# Altium schematic sheet 4g.SchDoc
size A2
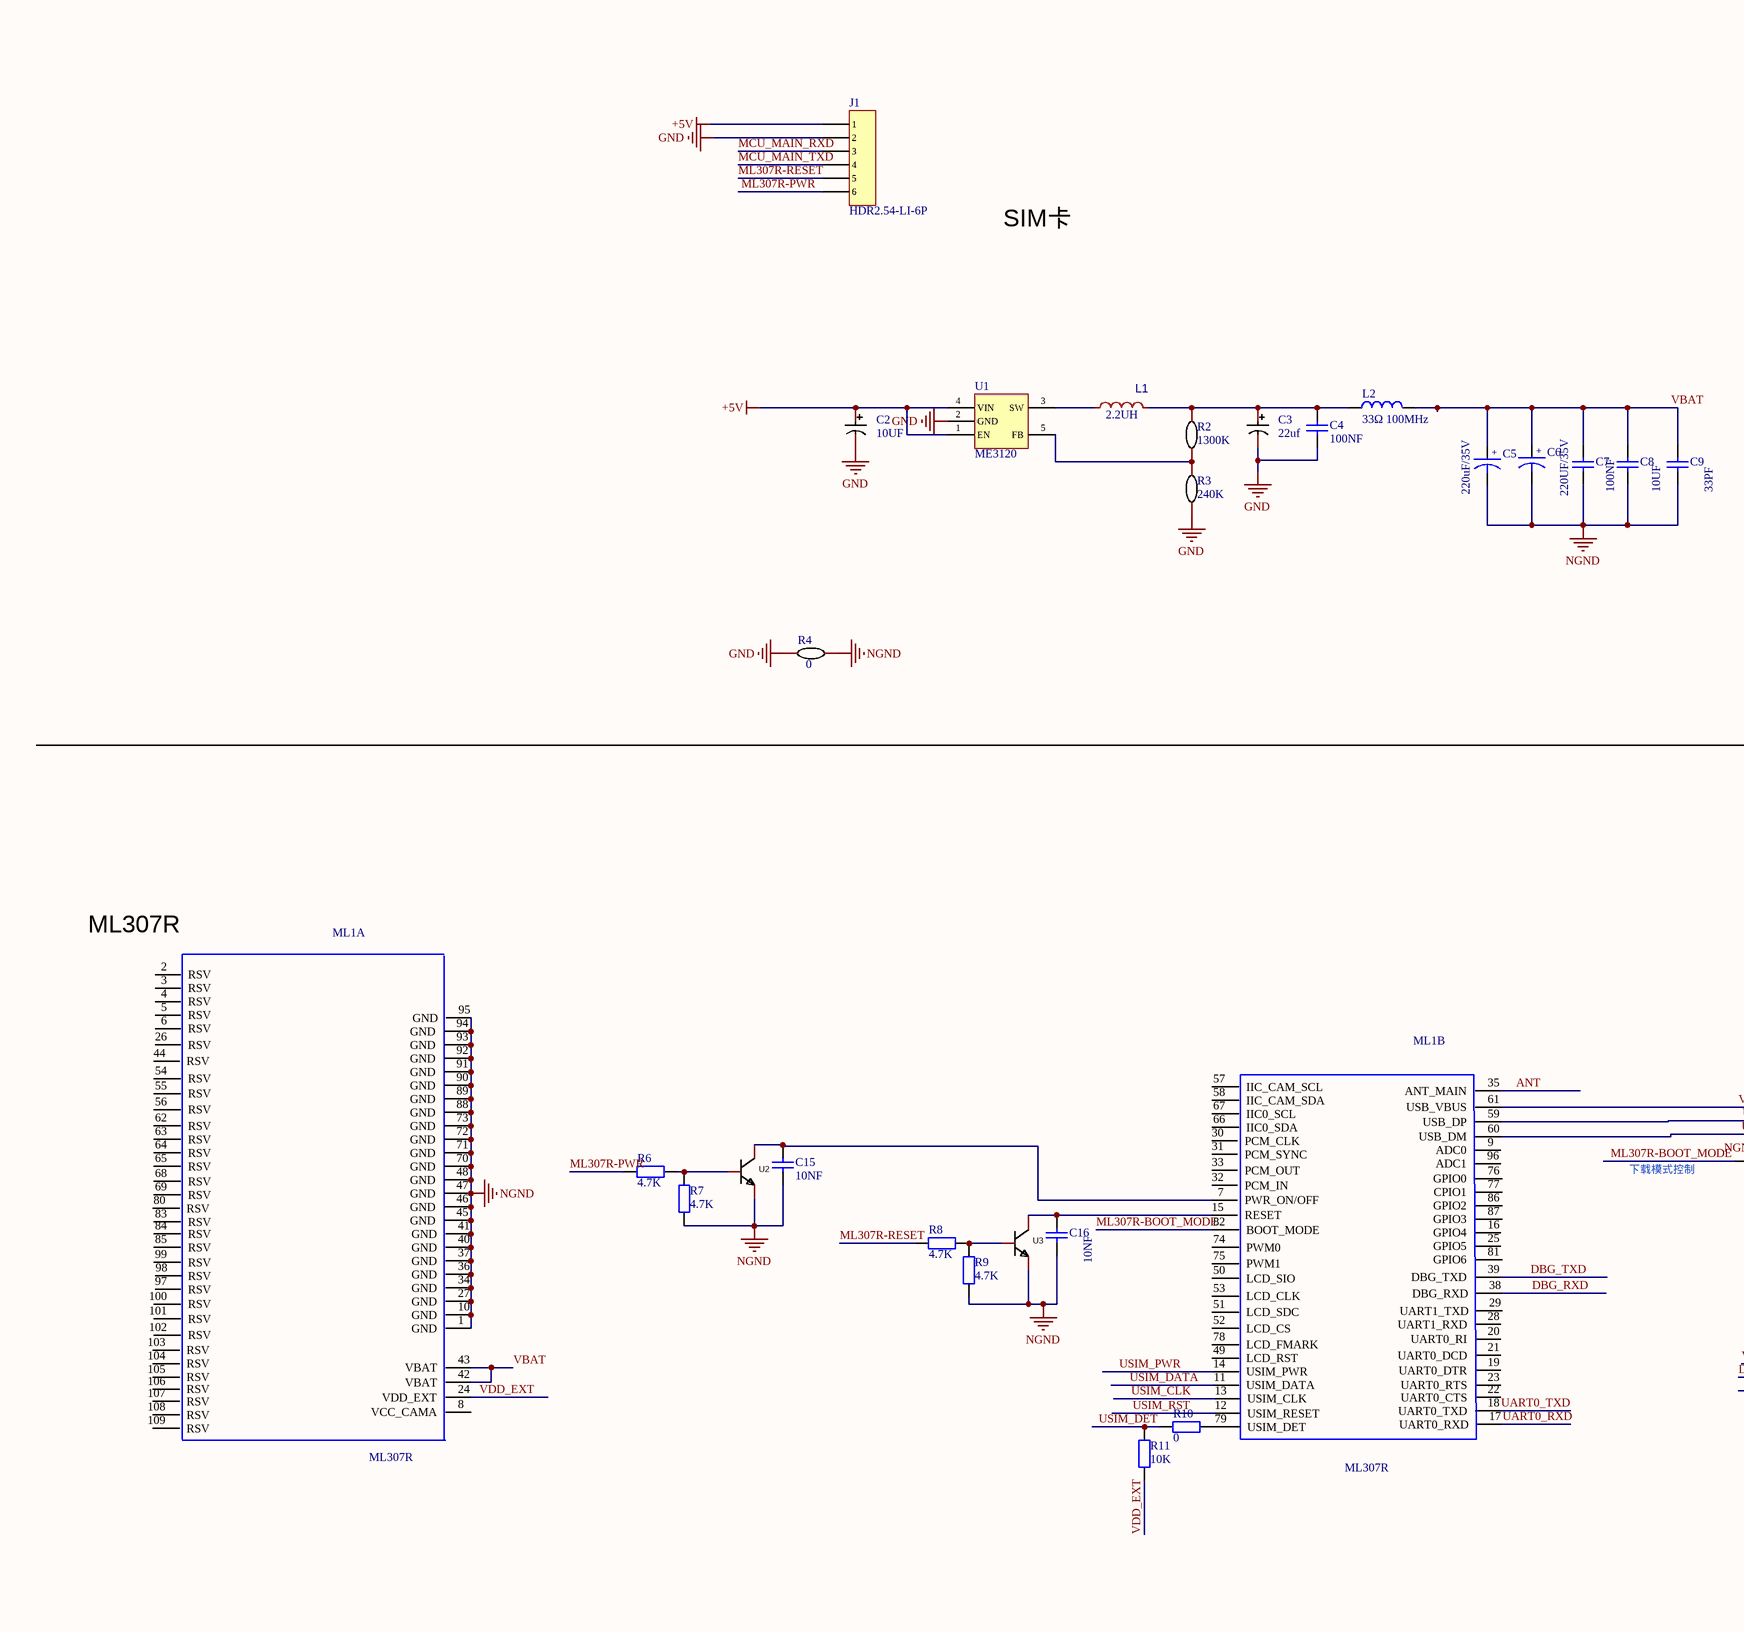
[diagram p0: 4g.SchDoc, left]
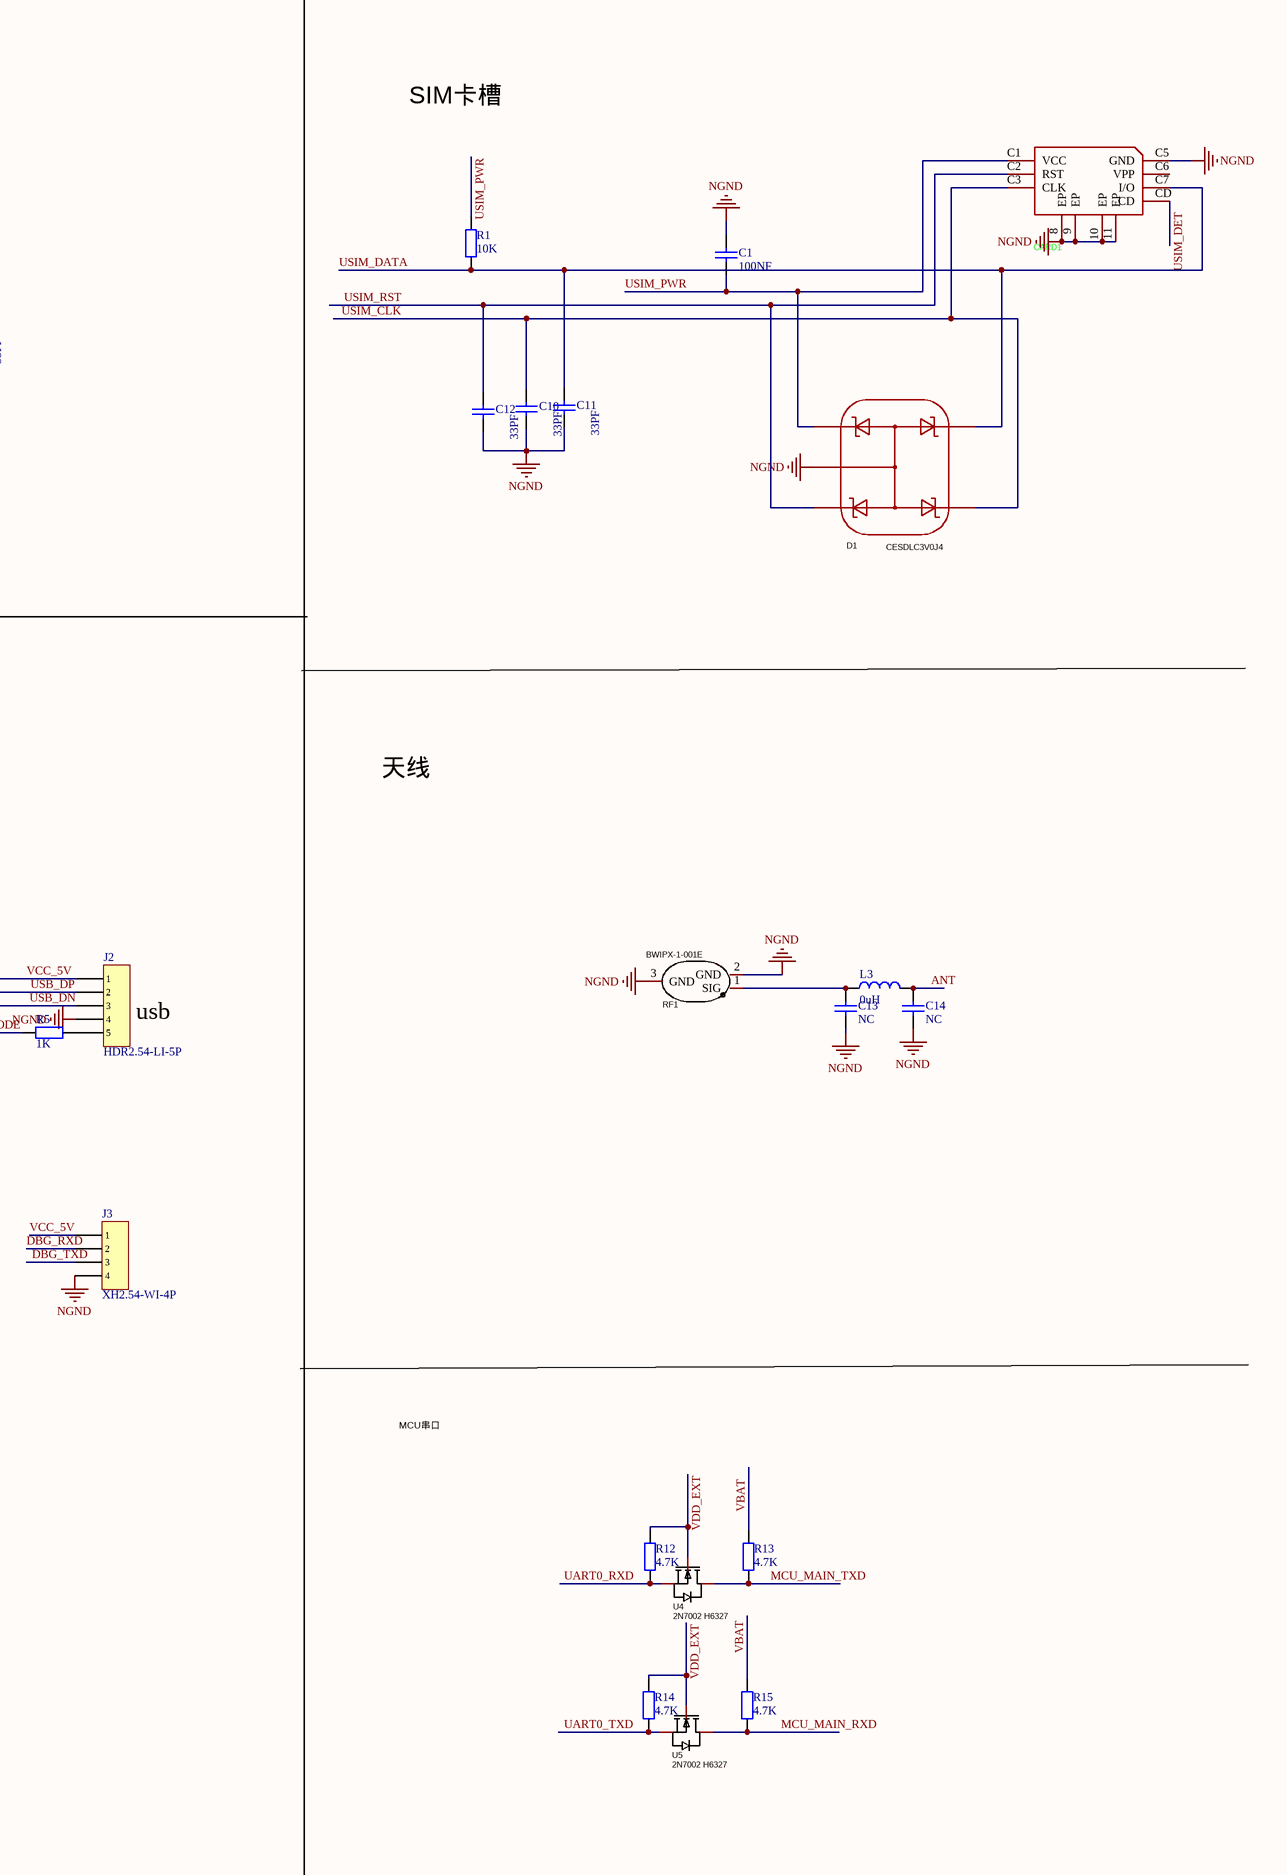
[diagram p1: 4g.SchDoc, right]

## Parts
C1  100NF  [C-0603]
C2  10UF  [CA-3216]
C3  22uf  [CA-3528]
C4  100NF  [R-0603]
C5  220uF/35V  [CASE-B_3528]
C6  220UF/35V  [CASE-B_3528]
C7  100NF  [C-0603]
C8  10UF  [C-0603]
C9  33PF  [C-0603]
C10  33PF  [C-0603]
C11  33PF  [C-0603]
C12  33PF  [C-0603]
C13  NC  [C-0603]
C14  NC  [C-0603]
C15  10NF  [C-0603]
C16  10NF  [C-0603]
CARD1  SMN-303  [SIM-SMD_SMN-303]  (value not drawn)
D1  CESDLC3V0J4  [SOT-353_L2.1-W1.3-P0.65-LS2.3-BR]
J1  HDR2.54-LI-6P  [HDR2.54-LI-6P]
J2  HDR2.54-LI-5P  [2.54--5P]
J3  XH2.54-WI-4P  [2.54--4P]
L1  2.2UH  [IND-SMD_L2.5-W2.0_MHCHL2520]
L2  33Ω 100MHz  [R-0805]
L3  0uH  [R-0603]
ML1  ML307R  [MOD_ML307X_LGA109P]  (parts A,B of 2)
R1  10K  [R-0603]
R2  1300K  [R-0603]
R3  240K  [R-0603]
R4  0  [R-0805]
R5  1K  [R-0603]
R6  4.7K  [R-0603]
R7  4.7K  [R-0603]
R8  4.7K  [R-0603]
R9  4.7K  [R-0603]
R10  0  [R-0603]
R11  10K  [R-0603]
R12  4.7K  [R-0603]
R13  4.7K  [R-0603]
R14  4.7K  [R-0603]
R15  4.7K  [R-0603]
RF1  BWIPX-1-001E  [IPEX-SMD_BWIPX-1-001E]
U1  ME3120  [SOT-23-5]
U2  SS8050  [SOT-23-3_(三极管)]  (value not drawn)
U3  SS8050  [SOT-23-3_(三极管)]  (value not drawn)
U4  2N7002 H6327  [PG-SOT23-3_L2.9-W1.3-P1.90-LS2.4-BR]
U5  2N7002 H6327  [PG-SOT23-3_L2.9-W1.3-P1.90-LS2.4-BR]

## Nets
+5V: C2.1 J1.1 U1.1(EN) U1.4(VIN)
GND: C2.2 C3.2 C4.1 J1.2 R3.2 R4.2 U1.2(GND)
NGND: C1.2 C5.2 C6.2 C7.1 C8.1 C9.1 C10.1 C11.1 C12.1 C13.2 C14.2 C15.1 C16.1 CARD1.8(EP) CARD1.9(EP) CARD1.10(EP) CARD1.11(EP) CARD1.C5(GND) D1.2 J2.4 J3.4 ML1.1(GND) ML1.10(GND) ML1.27(GND) ML1.34(GND) ML1.36(GND) ML1.37(GND) ML1.40(GND) ML1.41(GND) ML1.45(GND) ML1.46(GND) ML1.47(GND) ML1.48(GND) ML1.70(GND) ML1.71(GND) ML1.72(GND) ML1.73(GND) ML1.88(GND) ML1.89(GND) ML1.90(GND) ML1.91(GND) ML1.92(GND) ML1.93(GND) ML1.94(GND) ML1.95(GND) R4.1 R7.1 R9.1 RF1.2(GND) RF1.3(GND) U2.2(E) U3.2(E)
ANT: C14.1 L3.2 ML1.35(ANT_MAIN)
DBG_RXD: J3.2 ML1.38(DBG_RXD)
DBG_TXD: J3.3 ML1.39(DBG_TXD)
MCU_MAIN_RXD: J1.3 R15.1 U5.3(D)
MCU_MAIN_TXD: J1.4 R13.1 U4.3(D)
ML307R-BOOT_MODE: ML1.82(BOOT_MODE) R5.2
ML307R-PWR: J1.6 R6.1
ML307R-RESET: J1.5 R8.1
UART0_RXD: ML1.17(UART0_RXD) R12.1 U4.2(S)
UART0_TXD: ML1.18(UART0_TXD) R14.1 U5.2(S)
USB_DN: J2.3 ML1.60(USB_DM)
USB_DP: J2.2 ML1.59(USB_DP)
USIM_CLK: C10.2 CARD1.C3(CLK) D1.4 ML1.13(USIM_CLK)
USIM_DATA: C11.2 CARD1.C7(I/O) D1.5 ML1.11(USIM_DATA) R1.1
USIM_DET: CARD1.CD R10.2 R11.1
USIM_PWR: C1.1 CARD1.C1(VCC) D1.1 ML1.14(USIM_PWR) R1.2
USIM_RST: C12.2 CARD1.C2(RST) D1.3 ML1.12(USIM_RESET)
VBAT: C5.1 C6.1 C7.2 C8.2 C9.2 L2.2 ML1.42(VBAT) ML1.43(VBAT) R13.2 R15.2
VCC_5V: J2.1 J3.1 ML1.61(USB_VBUS)
VDD_EXT: ML1.24(VDD_EXT) R11.2 R12.2 R14.2 U4.1(G) U5.1(G)
NetC3_1: C3.1 C4.2 L1.2 L2.1 R2.1
NetC13_1: C13.1 L3.1 RF1.1(SIG)
NetC15_2: C15.2 ML1.7(PWR_ON/OFF) U2.3(C)
NetC16_2: C16.2 ML1.15(RESET) U3.3(C)
NetJ2_5: J2.5 R5.1
NetL1_1: L1.1 U1.3(SW)
NetML1_79: ML1.79(USIM_DET) R10.1
NetR2_2: R2.2 R3.1 U1.5(FB)
NetR6_2: R6.2 R7.2 U2.1(B)
NetR8_2: R8.2 R9.2 U3.1(B)

Not connected (* = marked no-connect by the designer): CARD1 C6(VPP); ML1 2(RSV) 3(RSV) 4(RSV) 5(RSV) 6(RSV) 8(VCC_CAMA) 9(ADC0) 16(GPIO4) 19(UART0_DTR) 20(UART0_RI) 21(UART0_DCD) 22(UART0_CTS) 23(UART0_RTS) 25(GPIO5) 26(RSV) 28(UART1_RXD) 29(UART1_TXD) 30(PCM_CLK) 31(PCM_SYNC) 32(PCM_IN) 33(PCM_OUT) 44(RSV) 49(LCD_RST) 50(LCD_SIO) 51(LCD_SDC) 52(LCD_CS) 53(LCD_CLK) 54(RSV) 55(RSV) 56(RSV) 57(IIC_CAM_SCL) 58(IIC_CAM_SDA) 62(RSV) 63(RSV) 64(RSV) 65(RSV) 66(IIC0_SDA) 67(IIC0_SCL) 68(RSV) 69(RSV) 74(PWM0) 75(PWM1) 76(GPIO0) 77(CPIO1) 78(LCD_FMARK) 80(RSV) 81(GPIO6) 83(RSV) 84(RSV) 85(RSV) 86(GPIO2) 87(GPIO3) 96(ADC1) 97(RSV) 98(RSV) 99(RSV) 100(RSV) 101(RSV) 102(RSV) 103(RSV) 104(RSV) 105(RSV) 106(RSV) 107(RSV) 108(RSV) 109(RSV)

## Notes on the sheet
- SIM卡
- SIM卡槽
- (near ML1) ML307R
- 天线
- 下载模式控制
- (near J2) usb
- MCU串口
- (in symbol C电解电容_1) +

## Library data of the parts
C1 C4 C7-C16 = 0603' 100pF 5% 50V NP0 车规: 贴片电容; 品牌: 国巨; 华芯物料编号: HXE0202045001; 厂商型号: AC0603JRNPO9BN101
C2 = KF470M050E110A: Manufacturer: CapXon(丰宾); Value: 470uF; Add into BOM: yes; Tolerance: ±20%; Rated Voltage: 50V; φD: 6.3mm; L: 11mm; Lifetime @ Temp: 2000hrs@105℃; Name: 10UF; Symbol: KF470M050E110A; Device: KF470M050E110A; Supplier: LCSC; Manufacturer Part: KF470M050E110A; Supplier Part: C59347; JLCPCB Part Class: 扩展库; LCSC Part Name: 47uF ±20% 50V; Supplier Footprint: 插件,D6.3xL11mm; Datasheet: https://atta.szlcsc.com/upload/public/pdf/source/20160702/1467448308274.pdf; Convert to PCB: yes; Lead Spacing: 2.5mm
C3 = KF470M050E110A: Manufacturer: CapXon(丰宾); Name: 10UF; Value: 470uF; Add into BOM: yes; Tolerance: ±20%; Rated Voltage: 50V; φD: 6.3mm; L: 11mm; Lifetime @ Temp: 2000hrs@105℃; Symbol: KF470M050E110A; Device: KF470M050E110A; Supplier: LCSC; Manufacturer Part: KF470M050E110A; Supplier Part: C59347; JLCPCB Part Class: 扩展库; LCSC Part Name: 47uF ±20% 50V; Supplier Footprint: 插件,D6.3xL11mm; Datasheet: https://atta.szlcsc.com/upload/public/pdf/source/20160702/1467448308274.pdf; Convert to PCB: yes; Lead Spacing: 2.5mm
C5 C6 = C电解电容_1: 电容
CARD1 = SMN-303: Manufacturer: XUNPU(讯普); Add into BOM: yes; Card Connection Mode: 自弹式; Card Type: NanoSIM卡; Connector Type: 卡座; Card Detection: 有插卡检测; Symbol: SMN-303; Device: SMN-303; LCSC Part Name: 自弹式 NanoSIM卡 卡座; Supplier Part: C266888; Manufacturer Part: SMN-303; Supplier Footprint: SMD; JLCPCB Part Class: Extended Part; Datasheet: https://item.szlcsc.com/datasheet/SMN-303/256999.html; Supplier: LCSC; Convert to PCB: yes; Supplementary Features: -; Height Above Board: 1.37mm; Operating Temperature: -40℃~+85℃
D1 = CESDLC3V0J4: Manufacturer: CJ(江苏长电/长晶); Add into BOM: yes; polarity: 单向; Reverse Stand-Off Voltage (Vrwm): 3V; Maximum Clamping Voltage: 8V; Peak Pulse Current (Ipp)@10/1000us: 2.5A; Breakdown Voltage: 5.3V; Type: ESD; Symbol: CESDLC3V0J4; Device: CESDLC3V0J4; LCSC Part Name: 单向ESD; Supplier Part: C337697; Manufacturer Part: CESDLC3V0J4; Supplier Footprint: SOT-353; JLCPCB Part Class: Extended Part; Datasheet: https://atta.szlcsc.com/upload/public/pdf/source/20181121/C337697_AC0D153A44294AFEE34B0495F85181F2.pdf; Supplier: LCSC; Convert to PCB: yes
J1 = HDR2.0-LI-6P: 直插立式单排针
J2 = HDR2.54-LI-5P: 直插立式单排针
J3 = XH2.54-WI-4P: XH卧式直插座
L1 = FTC252012S2R2MBCA: Symbol: FTC252012S2R2MBCA
L2 = 0603' 33Ω 100MHz 3A 车规: 磁珠; 品牌: 村田; 厂商型号: BLM18PG330SH1D; 华芯物料编号: HXE0301100005
L3 = 通用电感: 品牌: *; 厂商型号: *
ML1 = MOD_ML307X_LGA109P: MOD_ML307R_LCC48+LGA61_17.7mm*15.8mm; Vendor: 中移物联网有限公司; Value: ML307X; Manufacturer: ML307X; PCB DECAL: MOD_ML307X_LGA109P
R1 = 通用电阻
R2 R3 = 0805W8F1002T5E_C17414: 电阻类型:厚膜电阻;阻值:0; Manufacturer: UNI-ROYAL(厚声); Name: 0; Add into BOM: yes; Value: 100kΩ; Tolerance: ±1%; Power(Watts): 125mW; Temperature Coefficient: ±100ppm/℃; Overload Voltage (Max): 150V; Symbol: 0805W8F1002T5E; Device: 0805W8F1002T5E_C17414; LCSC Part Name: 10kΩ±1%125mW; Supplier Part: C17414; Manufacturer Part: 0805W8F1002T5E; Supplier Footprint: 0805; JLCPCB Part Class: BasicPart; Datasheet: https://atta.szlcsc.com/upload/public/pdf/source/20200306/C422600_1E6D84923E4A46A82E41ADD87F860B5C.pdf; Supplier: LCSC; Convert to PCB: yes; Type: 厚膜电阻; Operating Temperature Range: -55℃~+155℃
R4 = 0805W8F1002T5E_C17414: 电阻类型:厚膜电阻;阻值:0; Manufacturer: UNI-ROYAL(厚声); Add into BOM: yes; Value: 100kΩ; Tolerance: ±1%; Power(Watts): 125mW; Temperature Coefficient: ±100ppm/℃; Overload Voltage (Max): 150V; Name: 0; Symbol: 0805W8F1002T5E; Device: 0805W8F1002T5E_C17414; LCSC Part Name: 10kΩ±1%125mW; Supplier Part: C17414; Manufacturer Part: 0805W8F1002T5E; Supplier Footprint: 0805; JLCPCB Part Class: BasicPart; Datasheet: https://atta.szlcsc.com/upload/public/pdf/source/20200306/C422600_1E6D84923E4A46A82E41ADD87F860B5C.pdf; Supplier: LCSC; Convert to PCB: yes; Type: 厚膜电阻; Operating Temperature Range: -55℃~+155℃
R5-R15 = 通用电阻: 贴片电阻，未编号，未录入华芯元件库，临时封装，包括0201，0402，0603，0805，1206，1210，1812，2010，2512
RF1 = BWIPX-1-001E: Manufacturer: BAT WIRELESS(蝙蝠无线); Add into BOM: yes; Connector Type: 板端; Interface Type: 内针; Number of Ports: 1; Frequency-Max: 6GHz; RF Series: IPEX; Impedance: 50Ω; Symbol: BWIPX-1-001E; Device: BWIPX-1-001E; LCSC Part Name: IPEX 内针; Supplier Part: C496552; Manufacturer Part: BWIPX-1-001E; Supplier Footprint: SMD; JLCPCB Part Class: Extended Part; Datasheet: https://atta.szlcsc.com/upload/public/pdf/source/20201223/C496552_05E5A9956EAE1A8819C5051D085B1DED.pdf; Supplier: LCSC; Convert to PCB: yes; Interface Diameter: -; Interface Length/Height: -; Style: -; Operating Temperature Range: -
U1 = ME3120: 电源芯片; 品牌: 西安航天民芯; 厂商型号: MT3410LB; 华芯物料编号: HXE0003027001
U2 U3 = SS8050 NPN SOT-23: Manufacturer: 宏迦橙; Symbol: SS8050_C7420370; Add into BOM: yes; Transistor Type: NPN; Collector Current (Ic): 1.5A; Collector-Emitter Breakdown Voltage (Vceo): 25V; Power Dissipation (Pd): 300mW; DC Current Gain (hFE@Ic,Vce): 120@100mA,1.0V; Transition Frequency (fT): 100MHz; Collector Cut-Off Current (Icbo): 100nA; Collector-Emitter Saturation Voltage (VCE(sat)@Ic,Ib): 500mV@800mA,80mA; Name: SS8050; Device: SS8050_C7420370; LCSC Part Name: 耐压:25V 电流:1.5A NPN H档 200-350; Supplier Part: C7420370; Manufacturer Part: SS8050; Supplier Footprint: SOT-23; JLCPCB Part Class: Extended Part; Datasheet: https://atta.szlcsc.com/upload/public/pdf/source/20231222/9C4050A7669EB24B3ACD0418218817FD.pdf; Supplier: LCSC; Convert to PCB: yes; Operating Temperature: -55℃~+150℃
U4 U5 = 2N7002 H6327: Manufacturer: Infineon(英飞凌); Add into BOM: yes; Symbol: 2N7002 H6327; Device: 2N7002 H6327; LCSC Part Name: 2N7002 H6327; Supplier Part: C533095; Manufacturer Part: 2N7002 H6327; Supplier Footprint: SOT-23-3; JLCPCB Part Class: Extended Part; Datasheet: https://atta.szlcsc.com/upload/public/pdf/source/20220830/BD30B6441EBE5CA0CCBEB0FC11431461.pdf; Supplier: LCSC; Convert to PCB: yes